# Altium project DS139-1.0-B氧气传感器.PrjPcb
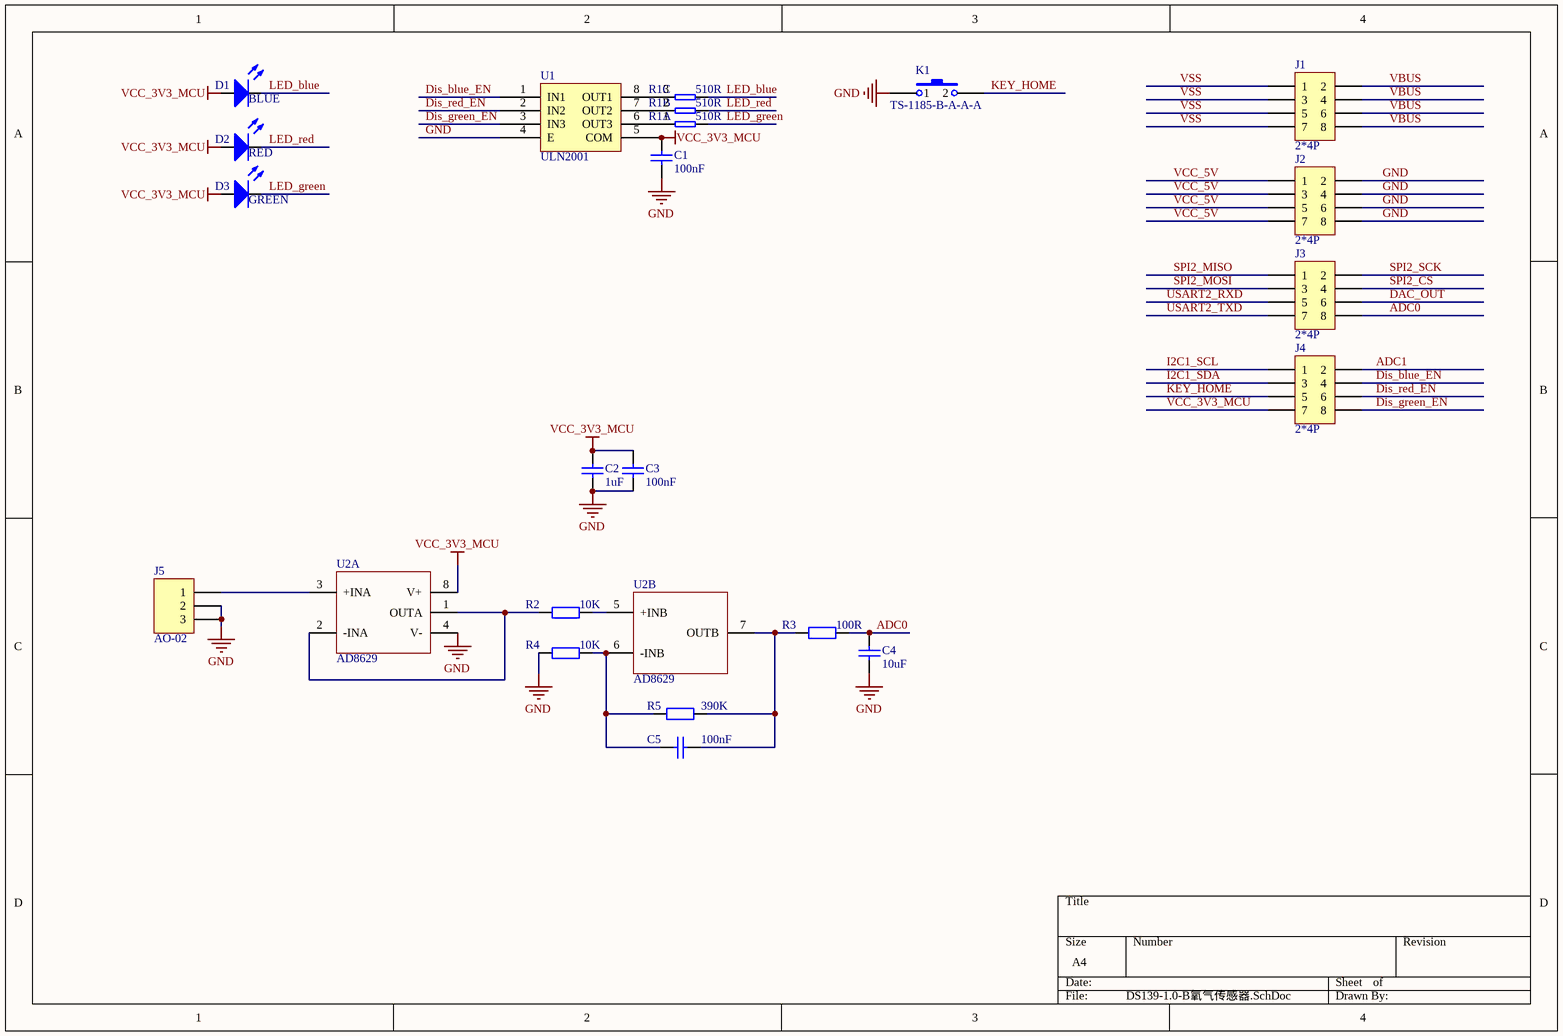
[diagram p0: DS139-1.0-B氧气传感器.SchDoc]
1 sheet, 21 parts. Net scope: global (net labels, ports and power ports of the same name join across sheets).
Board file: DS139-1.0-B氧气传感器.PcbDoc

## Sheet DS139-1.0-B氧气传感器.SchDoc
size A4; SheetNumber: 1; SheetTotal: 1

### Parts
C1  value 100nF  [0603CAP]  (hidden comment: SMDCAP00013)
C2  value 1uF  [0603CAP]  (hidden comment: SMDCAP00015)
C3  value 100nF  [0603CAP]  (hidden comment: SMDCAP00013)
C4  value 10uF  [0603CAP]  (hidden comment: SMDCAP00016)
C5  value 100nF  [0603CAP]  (hidden comment: SMDCAP00013)
D1  value BLUE  [LED_0805]  (hidden comment: SMDLED00010)
D2  value RED  [LED_0805]  (hidden comment: SMDLED00003)
D3  value GREEN  [LED_0805]  (hidden comment: Chip 翠绿LED 0805)
J1  value 2*4P  [X1321WVS-2x04J-C40D53]  (hidden comment: X1321WVS-2x04J-C40D53)
J2  value 2*4P  [X1321WVS-2x04J-C40D53]  (hidden comment: X1321WVS-2x04J-C40D53)
J3  value 2*4P  [X1321WVS-2x04J-C40D53]  (hidden comment: X1321WVS-2x04J-C40D53)
J4  value 2*4P  [X1321WVS-2x04J-C40D53]  (hidden comment: X1321WVS-2x04J-C40D53)
J5  value AO-02  [SIP3]  (hidden comment: SL000000042)
K1  TS-1185-B-A-A-A  [KEY_TS-1185-x-A-A-A]
R1  value 510R  [0603RES_Pack4]  (hidden comment: SMDRES05003)  (parts A,B,C of 4)
R2  value 10K  [0603RES]  (hidden comment: SMDRES00056)
R3  value 100R  [0603RES]  (hidden comment: SMDRES00015)
R4  value 10K  [0603RES]  (hidden comment: SMDRES00056)
R5  value 390K  [0603RES]  (hidden comment: SMDRES00079)
U1  value ULN2001  [SO-8]  (hidden comment: SMDIC000018)
U2  AD8629  [MSOP8]  (parts A,B of 2)

### Nets
GND: C1.1 C2.1 C3.1 C4.1 J2.2 J2.4 J2.6 J2.8 J5.2 J5.3 K1.1 R4.1 U1.4(E) U2.4(V-)
VCC_3V3_MCU: C1.2 C2.2 C3.2 D1.1(A) D2.1(A) D3.1(A) J4.7 U1.5(COM) U2.8(V+)
ADC0: C4.2 J3.8 R3.2
ADC1: J4.2
DAC_OUT: J3.6
Dis_blue_EN: J4.4 U1.1(IN1)
Dis_green_EN: J4.8 U1.3(IN3)
Dis_red_EN: J4.6 U1.2(IN2)
I2C1_SCL: J4.1
I2C1_SDA: J4.3
KEY_HOME: J4.5 K1.2
LED_blue: D1.2(K) R1.6
LED_green: D3.2(K) R1.8
LED_red: D2.2(K) R1.7
SPI2_CS: J3.4
SPI2_MISO: J3.1
SPI2_MOSI: J3.3
SPI2_SCK: J3.2
USART2_RXD: J3.5
USART2_TXD: J3.7
VBUS: J1.2 J1.4 J1.6 J1.8
VCC_5V: J2.1 J2.3 J2.5 J2.7
VSS: J1.1 J1.3 J1.5 J1.7
NetC5_1: C5.1 R4.2 R5.1 U2.6(-INB)
NetC5_2: C5.2 R3.1 R5.2 U2.7(OUTB)
NetJ5_1: J5.1 U2.3(+INA)
NetR1_1: R1.1 U1.6(OUT3)
NetR1_2: R1.2 U1.7(OUT2)
NetR1_3: R1.3 U1.8(OUT1)
NetR2_1: R2.1 U2.1(OUTA) U2.2(-INA)
NetR2_2: R2.2 U2.5(+INB)

### Library data of the parts
C1 C3 C5 = MLCC 100nF 50V ±10％ 0603: 贴片电容
C2 = MLCC 1uF 50V ±10％ 0603: 贴片电容
C4 = MLCC 10uF 50V ±10％ 0603: 贴片电容
D1 = Chip 蓝色LED 0805: 贴片LED
D2 = Chip 红色LED 0805: 贴片LED
D3 = Chip 翠绿LED 0805: 贴片LED
J1-J4 = X1321WVS-2x04J-C40D53: 双排针2x4P 立贴 1.27mm
J5 = DIP3 单排直针 间距2.54mm 针长11mm 铜: 单排直针
K1 = TS-1185-B-A-A-A: 轻触开关; Value: TS-1185-B-A-A-A
R1 = Chip R*4 510R 1/16W ±5％ 0603: 贴片排阻
R2 R4 = Chip 10K 1/16W ±1％ 0603: 贴片电阻
R3 = Chip 100R 1/16W ±1％ 0603: 贴片电阻
R5 = Chip 390K 1/16W ±1％ 0603: 贴片电阻
U1 = ULN2001 SOP-8: 电机驱动芯片
U2 = AD8629: 失调电压 ：1μV / 输入失调漂移： 0.005μV/℃ / 单电源：1.8-5.5V